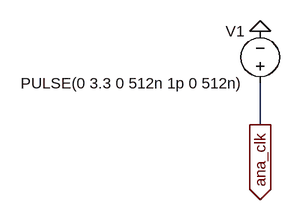
[diagram p0: schematic analog_clk.asc]
analog_clk.asc, the LTspice schematic file:
Version 4
SHEET 1 880 680
WIRE 336 352 336 288
FLAG 336 208 0
FLAG 336 352 ana_clk
IOPIN 336 352 Out
SYMBOL voltage 336 304 R180
WINDOW 0 24 96 Left 2
WINDOW 3 24 16 Left 2
SYMATTR InstName V1
SYMATTR Value PULSE(0 3.3 0 512n 1p 0 512n)

The netlist it stands for:
* analog_clk.asc
V1 ana_clk 0 PULSE(0 3.3 0 512n 1p 0 512n)
.backanno
.end